# Altium project RFSOC_SAWG.PrjPCB (part 7 of 10)

## Sheet ADC_Input_CH.SchDoc: RFSOC_SAWG
size 420 x 297 mm; CheckedBy: -; Author: G.Kasprowicz; CompanyName: WUT ISE; DrawnBy: G.Kasprowicz; Organization: WUT ISE; Address1: PW ISE; Address2: Nowowiejska 15/19 00-665 Warsaw; Address3: gkasprow@gmail.com; DocumentNumber: 2; Revision: 1; SheetNumber: 2; SheetTotal: 20; ModifiedBy: -; CheckedDate: -; Title2: ADC Input; DivGrp: WUT ISE; Designer: G.Kasprowicz; ModifiedDate: -; ProjectName: Sensor Box
Used 8 times, as channels U_ADC_Input_CH0, U_ADC_Input_CH1, U_ADC_Input_CH2, U_ADC_Input_CH3, U_ADC_Input_CH4, U_ADC_Input_CH5, U_ADC_Input_CH6, U_ADC_Input_CH7. Parts and nets are listed once, with the designators drawn on the sheet.
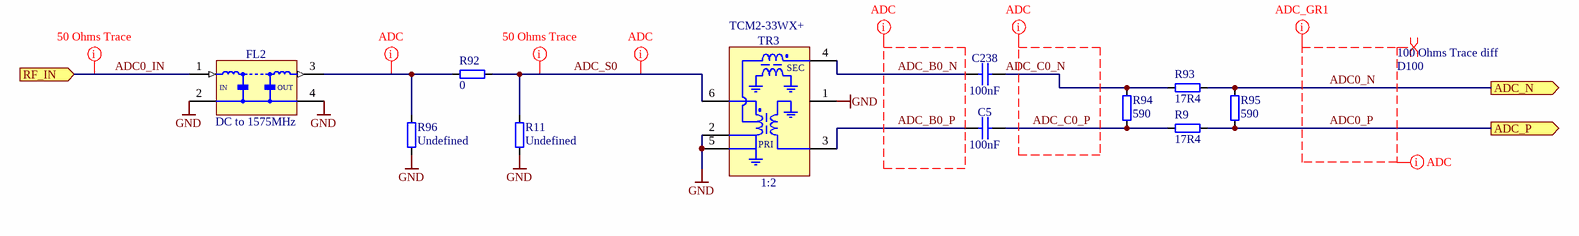
[diagram p13: ADC_Input_CH.SchDoc]

### Parts
C5  100nF  [CAPC0603X33N]
C238  100nF  [CAPC0603X33N]
FL2  DC to 1575MHz  [FIL_MINI-CIRCUITS_FV1206]
R9  17R4  [RESC1005X40N]
R11  Undefined  [RESC1005X40N]
R92  0  [RESC1005X40N]
R93  17R4  [RESC1005X40N]
R94  590  [RESC1005X40N]
R95  590  [RESC1005X40N]
R96  Undefined  [RESC1005X40N]
TR3  1:2  Manufacturer Part Number: TCM2-33WX+  [XFMR_MINI-CIRCUITS_DB1627]

### Ports
ADC_N (out), ADC_P (out), RF_IN (in)

### Nets
GND: FL2.2(GND) FL2.4(GND) R11.2 R96.2 TR3.1(NC) TR3.2(P) TR3.5(GND)
ADC0_IN: FL2.1(RFIN) ; port RF_IN
ADC0_N: R93.2 R95.1 ; port ADC_N
ADC0_P: R9.2 R95.2 ; port ADC_P
ADC_B0_N: C238.1 TR3.4(SD)
ADC_B0_P: C5.1 TR3.3(S)
ADC_C0_N: C238.2 R93.1 R94.1
ADC_C0_P: C5.2 R9.1 R94.2
ADC_S0: R11.1 R92.2 TR3.6(P1)
NetFL2_3: FL2.3(RFOUT) R92.1 R96.1

### Channels
U_ADC_Input_CH0: designators end in A; ports ADC_N=ADC0_N ADC_P=ADC0_P RF_IN=ADC0_IN
U_ADC_Input_CH1: designators end in B; ports ADC_N=ADC0_N ADC_P=ADC0_P RF_IN=ADC0_IN
U_ADC_Input_CH2: designators end in C; ports ADC_N=ADC0_N ADC_P=ADC0_P RF_IN=ADC0_IN
U_ADC_Input_CH3: designators end in D; ports ADC_N=ADC0_N ADC_P=ADC0_P RF_IN=ADC0_IN
U_ADC_Input_CH4: designators end in E; ports ADC_N=ADC0_N ADC_P=ADC0_P RF_IN=ADC0_IN
U_ADC_Input_CH5: designators end in F; ports ADC_N=ADC0_N ADC_P=ADC0_P RF_IN=ADC0_IN
U_ADC_Input_CH6: designators end in G; ports ADC_N=ADC0_N ADC_P=ADC0_P RF_IN=ADC0_IN
U_ADC_Input_CH7: designators end in H; ports ADC_N=ADC0_N ADC_P=ADC0_P RF_IN=ADC0_IN

### Layout directives
differential pair; differential pair class 100 Ohms Trace diff; net class D100: ADC0_N, ADC0_P
net class ADC_GR1: ADC0_N, ADC0_P
net class 50 Ohms Trace: ADC0_IN, ADC_S0_U_ADC_Input_CH0
net class ADC: ADC0_N, ADC0_P, ADC_B0_N, ADC_B0_P, ADC_C0_P, ADC_S0_U_ADC_Input_CH0, NetFL2A_3

### Notes on the sheet
- Project/Equipment
- Document
- Designer
- Drawn by
- Check.by
- Copyright WUT ISE 2020.
  This documentation describes Open Hardware and is licensed under the CERN OHL v.1.2. You may redistribute and modify this documentation under the terms of the CERN OHL v.1.2. (http://ohwr.org/CERNOHL). This documentation is distributed WITHOUT ANY EXPRESS OR IMPLIED WARRANTY, INCLUDING OF MERCHANTABILITY, SATISFACTORY QUALITY AND FITNESS FOR A PARTICULAR PURPOSE. Please see the CERN OHL v.1.2 for applicable conditions.
- Contact
- File
- Last Mod.
- Print Date
- Sheet
- Size
- A3
- of
- Rev
- (in symbol FIL_MINI-CIRCUITS_LFCN-1575+) IN; OUT
- (in symbol XFMR_MINI-CIRCUITS_TCM2-33WX+) SEC; PRI

### Library data of the parts
C5 C238 = CC0201_100NF_6.3V_10%_X5R: Non-polarised capacitor; Part Description: SMD Multilayer Chip Ceramic Capacitor; Manufacturer: GENERIC; Manufacturer1 Part Number: 02016D104KAT2A; Voltage: 6.3V; TC: X5R; Tolerance: ±10%; Part Number: CC0201_100NF_6.3V_10%_X5R; Component Kind: Standard; Component Type: Standard; Pin Count: 2; Value: 100nF; Status: Not Recommended; Manufacturer Part Number: CC0201_100NF_6.3V_10%_X5R; Case: 0201; Mounted: Yes; Socket: No; SMD: Yes; Sense: No; Manufacturer1 Example: AVX; Manufacturer1 ComponentHeight: 0.33mm; HelpURL: \\cern.ch\dfs\Applications\Altium\Datasheets\CC0201_X5R_AVX.pdf; Author: CERN DEM JLC; CreateDate: 03.12.2007; LatestRevisionDate: 03.12.2007
FL2 = FIL_MINI-CIRCUITS_LFCN-1575+: 50 Ohm Low Pass Filter; Part Number: FIL_MINI-CIRCUITS_LFCN-1575+; Component Kind: Standard; Component Type: Standard; Pin Count: 4; Value: DC to 1575MHz; Part Description: 50 Ohm Low Pass Filter; Manufacturer: MINI-CIRCUITS; Manufacturer Part Number: LFCN-1575+; Mounted: Yes; Socket: No; SMD: Yes; Sense: No; ComponentHeight: 0.94mm; HelpURL: \\cern.ch\dfs\Applications\Altium\Datasheets\FIL_MINI-CIRCUITS_LFCN-1575+.pdf; Author: CERN DEM JLC; CreateDate: 21.04.2014; LatestRevisionDate: 21.04.2015
R9 R93 = R0402_17R4_1%_0.1W_100PPM: Resistor - 1%; Part Description: General Purpose Thick Film Chip Resistor; Manufacturer: GENERIC; Manufacturer1 Part Number: ERJ2RKF17R4X; Voltage: 50V; Power: 0.1W; TC: ±100ppm/°C; PressFit: No; Case: 0402; Value: 17R4; Tolerance: ±1%; Part Number: R0402_17R4_1%_0.1W_100PPM; Component Kind: Standard; Component Type: Standard; Pin Count: 2; Status: Not Recommended; Manufacturer Part Number: R0402_17R4_1%_0.1W_100PPM; Mounted: Yes; Sense: No; Socket: No; SMD: Yes; Manufacturer1 Example: PANASONIC; Manufacturer1 ComponentHeight: 0.4mm; HelpURL: \\cern.ch\dfs\Applications\Altium\Datasheets\R0402_PANASONIC_ERJ2RK.pdf; Author: CERN DEM BC; CreateDate: 19.04.2021; LatestRevisionDate: 19.04.2021
R11 R96 = R0402_NO-VALUE: Resistor; Part Description: Reserved Footprint For a 0402 (1005) Chip Resistor; PressFit: No; Mounted: No; Case: 0402; Value: Undefined; Part Number: R0402_NO-VALUE; Component Kind: Standard; Component Type: Standard; Pin Count: 2; Status: None; Manufacturer: Undefined; Manufacturer Part Number: R0402_NO-VALUE; Sense: No; Socket: No; SMD: Yes; Manufacturer1 Example: Undefined; Manufacturer1 Part Number: Undefined; Manufacturer1 ComponentHeight: Undefined; HelpURL: Undefined; Author: CERN DEM JLC; CreateDate: 03.12.2007; LatestRevisionDate: 13.03.2008
R92 = R0402_0R_JUMPER: Resistor; Part Description: 1A (0.05R Max DC Resistance) Zero Ohm Jumper; Manufacturer: GENERIC; Manufacturer1 Part Number: 232270591001L; PressFit: No; Case: 0402; Value: 0; Part Number: R0402_0R_JUMPER; Component Kind: Standard; Component Type: Standard; Pin Count: 2; Status: Not Recommended; Manufacturer Part Number: R0402_0R_JUMPER; Mounted: Yes; Sense: No; Socket: No; SMD: Yes; Manufacturer1 Example: YAGEO PHYCOMP; Manufacturer1 ComponentHeight: 0.4mm; HelpURL: \\cern.ch\dfs\Applications\Altium\Datasheets\R0402_Phycomp_RC0402.pdf; Author: CERN DEM JLC; CreateDate: 03.12.2007; LatestRevisionDate: 17.10.2012
R94 R95 = R0402_590R_1%_0.1W_100PPM: Resistor - 1%; Part Description: General Purpose Thick Film Chip Resistor; Manufacturer: GENERIC; Manufacturer1 Part Number: ERJ2RKF5900X; Voltage: 50V; Power: 0.1W; TC: ±100ppm/°C; PressFit: No; Case: 0402; Value: 590; Tolerance: ±1%; Part Number: R0402_590R_1%_0.1W_100PPM; Component Kind: Standard; Component Type: Standard; Pin Count: 2; Status: Not Recommended; Manufacturer Part Number: R0402_590R_1%_0.1W_100PPM; Mounted: Yes; Sense: No; Socket: No; SMD: Yes; Manufacturer1 Example: PANASONIC; Manufacturer1 ComponentHeight: 0.4mm; HelpURL: \\cern.ch\dfs\Applications\Altium\Datasheets\R0402_PANASONIC_ERJ2RK.pdf; Author: CERN DEM BC; CreateDate: 19.04.2021; LatestRevisionDate: 19.04.2021
TR3 = XFMR_MINI-CIRCUITS_TCM2-33WX+: 50 OHMS 10 to 3000 MHz RF Transformer; Power: 0.4W; Part Number: XFMR_MINI-CIRCUITS_TCM2-33WX+; Component Kind: Standard; Component Type: Standard; Pin Count: 6; Value: 1:2; Status: None; Part Description: 50 Ohms 10 to 3000MHz RF Transformer; Manufacturer: MINI-CIRCUITS; Mounted: Yes; Socket: No; Sense: No; SMD: Yes; ComponentHeight: 4.06mm; HelpURL: \\cern.ch\dfs\Applications\Altium\Datasheets\XFMR_MINI-CIRCUITS_TCM2-33WX+.pdf; Author: CERN DEM MR; CreateDate: 01.12.2016; LatestRevisionDate: 01.12.2016

## Sheet AWG_SFPs.SchDoc: SFP
size 420 x 297 mm; EDA_Number: ARTIQ; Projet: ARTIQ/SINARA; CheckedBy: G.Kasprowicz; Author: F.Switakowski; CompanyName: WUT ISE; DrawnBy: F.Switakowski; Organization: WUT ISE; Address1: PW ISE; Address2: Nowowiejska 15/19 00-665 Warsaw; Address3: gkasprow@gmail.com; DocumentNumber: 8; Revision: 1; SheetNumber: 8; SheetTotal: 20; ModifiedBy: -; CheckedDate: -; Title2: cages; DivGrp: WUT ISE; Designer: G.Kasprowicz; ModifiedDate: -; ProjectName: Sensor Box
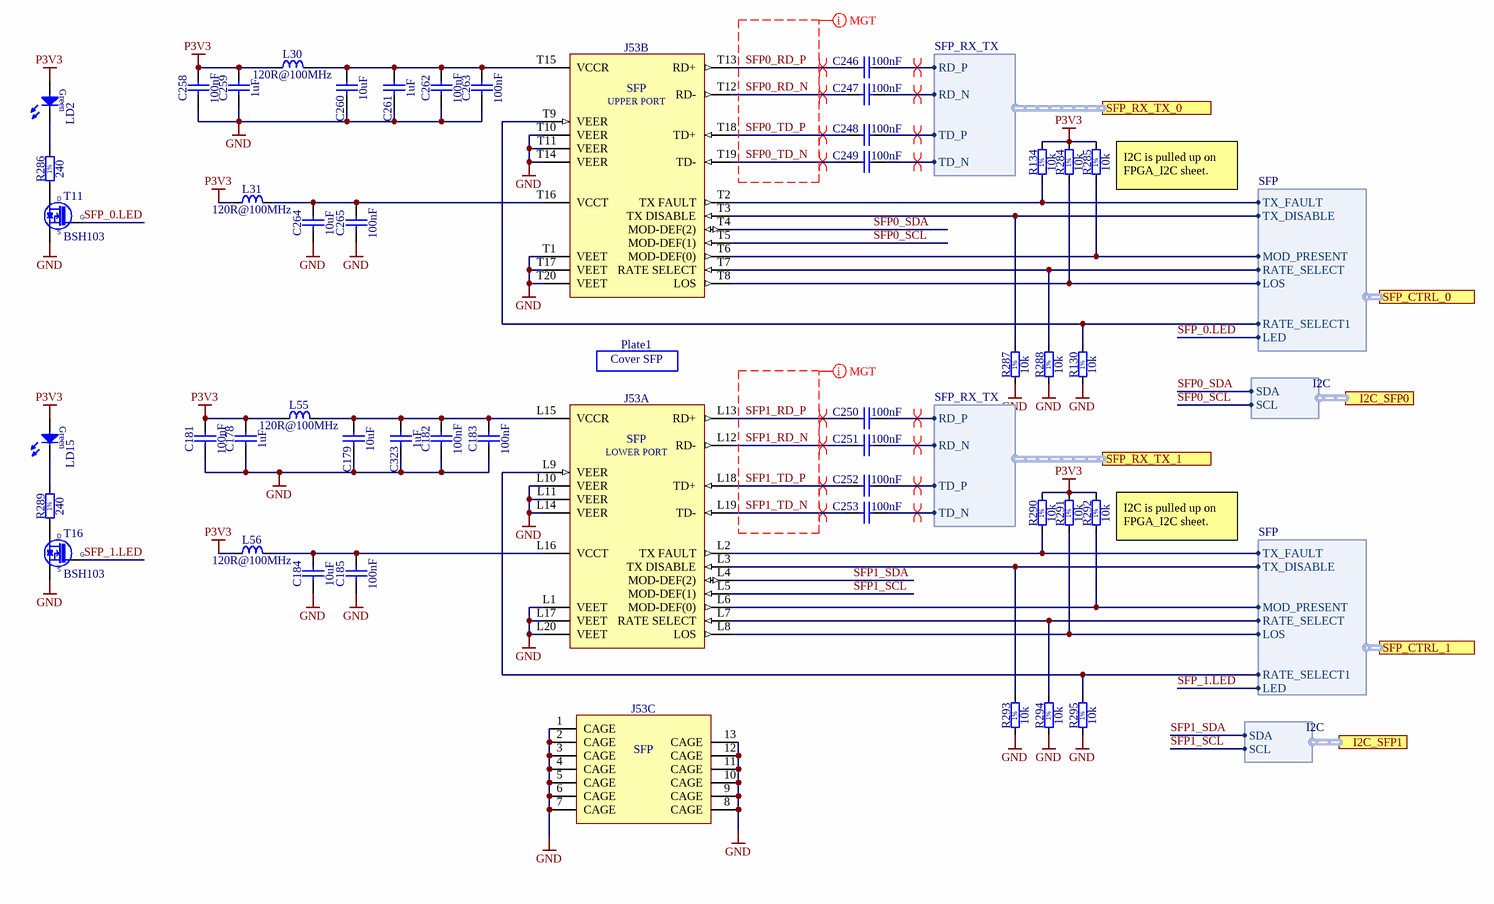
[diagram p14: AWG_SFPs.SchDoc]

### Parts
C178  1uF  [CAPC1005X55N]
C179  10uF  [CAPC2012X95N]
C181  100nF  [CAPC1005X55N]
C182  100nF  [CAPC1005X55N]
C183  100nF  [CAPC1005X55N]
C184  10uF  [CAPC2012X95N]
C185  100nF  [CAPC1005X55N]
C246  100nF  [CAPC0603X33N]
C247  100nF  [CAPC0603X33N]
C248  100nF  [CAPC0603X33N]
C249  100nF  [CAPC0603X33N]
C250  100nF  [CAPC0603X33N]
C251  100nF  [CAPC0603X33N]
C252  100nF  [CAPC0603X33N]
C253  100nF  [CAPC0603X33N]
C258  100nF  [CAPC1005X55N]
C259  1uF  [CAPC1005X55N]
C260  10uF  [CAPC2012X95N]
C261  1uF  [CAPC1005X55N]
C262  100nF  [CAPC1005X55N]
C263  100nF  [CAPC1005X55N]
C264  10uF  [CAPC2012X95N]
C265  100nF  [CAPC1005X55N]
C323  1uF  [CAPC1005X55N]
J53  SFP  [MOLEX_75640-5001]  (parts A,B,C of 3)
L30  120R@100MHz  [INDC1608X65N]
L31  120R@100MHz  [INDC1608X65N]
L55  120R@100MHz  [INDC1608X65N]
L56  120R@100MHz  [INDC1608X65N]
LD2  Green  [LED_AVAGO_HSME-C120]  (value not drawn)
LD15  Green  [LED_AVAGO_HSME-C120]  (value not drawn)
Plate1  Cover SFP  [AMPHENOL_U77A11108000P]
R130  10k  [RESC1005X40N]
R134  10k  [RESC1005X40N]
R284  10k  [RESC1005X40N]
R285  10k  [RESC1005X40N]
R286  240  [RESC1005X40N]
R287  10k  [RESC1005X40N]
R288  10k  [RESC1005X40N]
R289  240  [RESC1005X40N]
R290  10k  [RESC1005X40N]
R291  10k  [RESC1005X40N]
R292  10k  [RESC1005X40N]
R293  10k  [RESC1005X40N]
R294  10k  [RESC1005X40N]
R295  10k  [RESC1005X40N]
T11  BSH103  [SOT95P230X110-3N]
T16  BSH103  [SOT95P230X110-3N]

### Ports
I2C_SFP0 (harness I2C), I2C_SFP1 (harness I2C), SFP_CTRL_0 (harness SFP), SFP_CTRL_1 (harness SFP), SFP_RX_TX_0 (harness SFP_RX_TX), SFP_RX_TX_1 (harness SFP_RX_TX)

### Harnesses
SFP_RX_TX: RD_P, RD_N, TD_P, TD_N
SFP: TX_FAULT, LOS, MOD_PRESENT, TX_DISABLE, RATE_SELECT, LED, RATE_SELECT1
I2C: SDA, SCL

### Nets
GND: C178.1 C179.1 C181.1 C182.1 C183.1 C184.1 C185.1 C258.1 C259.1 C260.1 C261.1 C262.1 C263.1 C264.1 C265.1 C323.1 J53.1(CAGE) J53.2(CAGE) J53.3(CAGE) J53.4(CAGE) J53.5(CAGE) J53.6(CAGE) J53.7(CAGE) J53.8(CAGE) J53.9(CAGE) J53.10(CAGE) J53.11(CAGE) J53.12(CAGE) J53.13(CAGE) J53.L1(VEET) J53.L10(VEER) J53.L11(VEER) J53.L14(VEER) J53.L17(VEET) J53.L20(VEET) J53.T1(VEET) J53.T10(VEER) J53.T11(VEER) J53.T14(VEER) J53.T17(VEET) J53.T20(VEET) R130.1 R287.1 R288.1 R293.1 R294.1 R295.1 T11.2(S) T16.2(S)
P3V3: C178.2 C181.2 C258.2 C259.2 L30.1 L31.1 L55.1 L56.1 LD2.2(A) LD15.2(A) R134.2 R284.2 R285.2 R290.2 R291.2 R292.2
B129_RX0_N: C247.2 ; port SFP_RX_TX_0.RD_N
B129_RX0_P: C246.2 ; port SFP_RX_TX_0.RD_P
B129_RX1_N: C251.2 ; port SFP_RX_TX_1.RD_N
B129_RX1_P: C250.2 ; port SFP_RX_TX_1.RD_P
B129_TX0_N: C249.2 ; port SFP_RX_TX_0.TD_N
B129_TX0_P: C248.2 ; port SFP_RX_TX_0.TD_P
B129_TX1_N: C253.2 ; port SFP_RX_TX_1.TD_N
B129_TX1_P: C252.2 ; port SFP_RX_TX_1.TD_P
SFP0_LOS: J53.T8(LOS) R284.1 ; port SFP_CTRL_0.LOS
SFP0_MOD_PRESENT: J53.T6(MOD-DEF(0)) R285.1 ; port SFP_CTRL_0.MOD_PRESENT
SFP0_RATE_SELECT: J53.T7(RATE_SELECT) R288.2 ; port SFP_CTRL_0.RATE_SELECT
SFP0_RATE_SELECT1: J53.T9(VEER) R130.2 ; port SFP_CTRL_0.RATE_SELECT1
SFP0_RD_N: C247.1 J53.T12(RD-)
SFP0_RD_P: C246.1 J53.T13(RD+)
SFP0_SCL: J53.T5(MOD-DEF(1)) ; port I2C_SFP0.SCL
SFP0_SDA: J53.T4(MOD-DEF(2)) ; port I2C_SFP0.SDA
SFP0_TD_N: C249.1 J53.T19(TD-)
SFP0_TD_P: C248.1 J53.T18(TD+)
SFP0_TX_DISABLE: J53.T3(TX_DISABLE) R287.2 ; port SFP_CTRL_0.TX_DISABLE
SFP0_TX_FAULT: J53.T2(TX_FAULT) R134.1 ; port SFP_CTRL_0.TX_FAULT
SFP1_LOS: J53.L8(LOS) R291.1 ; port SFP_CTRL_1.LOS
SFP1_MOD_PRESENT: J53.L6(MOD-DEF(0)) R292.1 ; port SFP_CTRL_1.MOD_PRESENT
SFP1_RATE_SELECT: J53.L7(RATE_SELECT) R294.2 ; port SFP_CTRL_1.RATE_SELECT
SFP1_RATE_SELECT1: J53.L9(VEER) R295.2 ; port SFP_CTRL_1.RATE_SELECT1
SFP1_RD_N: C251.1 J53.L12(RD-)
SFP1_RD_P: C250.1 J53.L13(RD+)
SFP1_SCL: J53.L5(MOD-DEF(1)) ; port I2C_SFP1.SCL
SFP1_SDA: J53.L4(MOD-DEF(2)) ; port I2C_SFP1.SDA
SFP1_TD_N: C253.1 J53.L19(TD-)
SFP1_TD_P: C252.1 J53.L18(TD+)
SFP1_TX_DISABLE: J53.L3(TX_DISABLE) R293.2 ; port SFP_CTRL_1.TX_DISABLE
SFP1_TX_FAULT: J53.L2(TX_FAULT) R290.1 ; port SFP_CTRL_1.TX_FAULT
SFP_0.LED: T11.1(G) ; port SFP_CTRL_0.LED  [project net SFP0_LED]
SFP_1.LED: T16.1(G) ; port SFP_CTRL_1.LED  [project net SFP1_LED]
NetC179_2: C179.2 C182.2 C183.2 C323.2 J53.L15(VCCR) L55.2
NetC184_2: C184.2 C185.2 J53.L16(VCCT) L56.2
NetC260_2: C260.2 C261.2 C262.2 C263.2 J53.T15(VCCR) L30.2
NetC264_2: C264.2 C265.2 J53.T16(VCCT) L31.2
NetLD2_1: LD2.1(C) R286.2
NetLD15_1: LD15.1(C) R289.2
NetR286_1: R286.1 T11.3(D)
NetR289_1: R289.1 T16.3(D)

### Layout directives
differential pair; differential pair class Diff_100Ohm: B129_RX0_N, B129_RX0_P, B129_RX1_N, B129_RX1_P, B129_TX0_N, B129_TX0_P, B129_TX1_N, B129_TX1_P, SFP0_RD_N, SFP0_RD_P, SFP0_TD_N, SFP0_TD_P, SFP1_RD_N, SFP1_RD_P, SFP1_TD_N, SFP1_TD_P
net class MGT: SFP0_RD_N, SFP0_RD_P, SFP0_TD_N, SFP0_TD_P, SFP1_RD_N, SFP1_RD_P, SFP1_TD_N, SFP1_TD_P

### Notes on the sheet
- (near R285) I2C is pulled up on FPGA_I2C sheet.
- (near R292) I2C is pulled up on FPGA_I2C sheet.
- Project/Equipment
- Document
- Designer
- Drawn by
- Check.by
- Copyright WUT ISE 2020.
  This documentation describes Open Hardware and is licensed under the CERN OHL v.1.2. You may redistribute and modify this documentation under the terms of the CERN OHL v.1.2. (http://ohwr.org/CERNOHL). This documentation is distributed WITHOUT ANY EXPRESS OR IMPLIED WARRANTY, INCLUDING OF MERCHANTABILITY, SATISFACTORY QUALITY AND FITNESS FOR A PARTICULAR PURPOSE. Please see the CERN OHL v.1.2 for applicable conditions.
- Contact
- File
- Last Mod.
- Print Date
- Sheet
- Size
- A3
- of
- Rev
- (in symbol MOLEX_75640-5001, part A) LOWER PORT
- (in symbol MOLEX_75640-5001, part B) UPPER PORT
- (in symbol R0402_10K_1%_0.0625W_100PPM) 1%
- (in symbol R0402_240R_1%_0.0625W_100PPM) 1%

### Library data of the parts
C178 C259 C261 C323 = CC0402_1UF_16V_10%_X5R: Non-polarised capacitor; Part Description: SMD Multilayer Chip Ceramic Capacitor; Manufacturer: GENERIC; Manufacturer1 Part Number: C1005X5R1C105KT; Voltage: 16V; TC: X5R; Tolerance: ±10%; Part Number: CC0402_1UF_16V_10%_X5R; Component Kind: Standard; Component Type: Standard; Pin Count: 2; Value: 1uF; Status: Preferred; Manufacturer Part Number: CC0402_1UF_16V_10%_X5R; Case: 0402; Mounted: Yes; Socket: No; SMD: Yes; Sense: No; Manufacturer1 Example: TDK; Manufacturer1 ComponentHeight: 0.55mm; HelpURL: \\cern.ch\dfs\Applications\Altium\Datasheets\CC0402_X5R_TDK_C.pdf; Author: CERN DEM JLC; CreateDate: 2012-10-25; LatestRevisionDate: 2012-10-25
C179 C184 C260 C264 = CC0805_10UF_25V_10%_X5R: Non-polarised capacitor; Part Description: SMD Multilayer Chip Ceramic Capacitor; Manufacturer: GENERIC; Manufacturer1 Part Number: GRM219R61E106KA12D; Voltage: 25V; TC: X5R; Tolerance: ±10%; Part Number: CC0805_10UF_25V_10%_X5R; Component Kind: Standard; Component Type: Standard; Pin Count: 2; Value: 10uF; Status: Preferred; Manufacturer Part Number: CC0805_10UF_25V_10%_X5R; Case: 0805; Mounted: Yes; Socket: No; SMD: Yes; Sense: No; Manufacturer1 Example: MURATA; Manufacturer1 ComponentHeight: 0.95mm; HelpURL: \\cern.ch\dfs\Applications\Altium\Datasheets\CC0805_X5R_MURATA_GRM.pdf; Author: CERN DEM JLC; CreateDate: 25.10.2012; LatestRevisionDate: 06.09.2016
C181-C183 C185 C258 C262 C263 C265 = CC0402_100NF_16V_10%_X7R: Non-polarised capacitor; Part Description: SMD Multilayer Chip Ceramic Capacitor; Manufacturer: GENERIC; Manufacturer1 Part Number: GRM155R71C104KA88D; Voltage: 16V; TC: X7R; Tolerance: ±10%; Part Number: CC0402_100NF_16V_10%_X7R; Component Kind: Standard; Component Type: Standard; Pin Count: 2; Value: 100nF; Status: Not Recommended; Manufacturer Part Number: CC0402_100NF_16V_10%_X7R; Case: 0402; Mounted: Yes; Socket: No; SMD: Yes; Sense: No; Manufacturer1 Example: MURATA; Manufacturer1 ComponentHeight: 0.55mm; HelpURL: \\cern.ch\dfs\Applications\Altium\Datasheets\CC0402_X7R_MURATA_GRM.pdf; Author: CERN DEM JLC; CreateDate: 05/12/2013; LatestRevisionDate: 03/12/2007
C246-C253 = CC0201_100NF_6.3V_10%_X5R: as C5 on sheet ADC_Input_CH; Part Number: CC0201_100NF_6.3V_10%_X5R; Component Kind: Standard; Component Type: Standard; Pin Count: 2; Value: 100nF; Status: Not Recommended; Manufacturer Part Number: CC0201_100NF_6.3V_10%_X5R; Case: 0201; Mounted: Yes; Socket: No; SMD: Yes; Sense: No; Manufacturer1 Example: AVX; Manufacturer1 ComponentHeight: 0.33mm; HelpURL: \\cern.ch\dfs\Applications\Altium\Datasheets\CC0201_X5R_AVX.pdf; Author: CERN DEM JLC; CreateDate: 2007-12-03; LatestRevisionDate: 2007-12-03; ClassName: SATA
J53 = MOLEX_75640-5001: Dual 20 Positions Stacked SFP (Small Form-factor Pluggable) Receptacles with 4 Light Pipes, Medium Height Assembly, Press Fit Tails; Part Description: Dual Stacked SFP Cage (Small Form-factor Pluggable) with 2x20 Positions Integrated Receptacles and 4 Light Pipes (Press Fit Tails); Manufacturer: MOLEX; Part Number: MOLEX_75640-5001; Component Kind: Standard; Component Type: Standard; Pin Count: 53; Family: SFP; Mounted: Yes; Socket: No; SMD: Yes; PressFit: Yes; Sense: No; Status: None; Manufacturer Part Number: 75640-5001; ComponentHeight: 25.8mm; HelpURL: \\cern.ch\dfs\Applications\Altium\Datasheets\MOLEX_75640-5001.pdf; Author: CERN DEM JLC; CreateDate: 15.10.2013; LatestRevisionDate: 15.10.2013
L30 L31 L55 L56 = IND0603_MURATA_BLM18SG121TN1D: Inductor; Part Description: SMD EMIFIL Suppression Chip Ferrite Bead; Manufacturer: MURATA; Power: 3A; Resistance: 0.025R; Tolerance: ±25%; Part Number: IND0603_MURATA_BLM18SG121TN1D; Component Kind: Standard; Component Type: Standard; Pin Count: 2; Value: 120R@100MHz; Status: None; Manufacturer Part Number: BLM18SG121TN1D; Case: 0603; Mounted: Yes; Socket: No; SMD: Yes; Sense: No; ComponentHeight: 0.65mm; HelpURL: \\cern.ch\dfs\Applications\Altium\Datasheets\IND0603_MURATA_BLM18S.pdf; Author: CERN DEM JLC; CreateDate: 23.07.2014; LatestRevisionDate: 23.07.2014
LD2 LD15 = LED_AVAGO_HSME-C120: LED Green 1C 2A; Part Description: High Performance Right Angle Chip Green LED; Manufacturer: AVAGO TECHNOLOGIES; PressFit: No; Bonding: No; Part Number: LED_AVAGO_HSME-C120; Component Kind: Standard; Component Type: Standard; Color: Green; PackageDescription: Green Chip LED, 2-Leads, Body 1.7x1.1mm, Side Emitting Package; Manufacturer Part Number: HSME-C120; Pin Count: 2; Mounted: Yes; Socket: No; SMD: Yes; Sense: No; ComponentHeight: 0.7mm; HelpURL: \\cern.ch\dfs\Applications\Altium\Datasheets\LED_AVAGO_HSME-C120.pdf; ComponentLink1URL: \\cern.ch\dfs\Applications\Altium\Datasheets\LED_AVAGO_HSME-C110_DESIGN-GUIDE.pdf; ComponentLink1Description: Design Guide; Author: CERN DEM JMW; CreateDate: 22.07.2009; LatestRevisionDate: 20.06.2012
Plate1 = AMPHENOL_U77A11108000P: Plastic Dust Cover SFP Cage; PressFit: No; Part Number: AMPHENOL_U77A11108000P; Component Kind: Accessories; Component Type: Standard; Pin Count: 0; PackageDescription: Plastic Dust Cover SFP Cage; Mounted: Yes; Socket: No; SMD: No; Sense: No; Status: None; Value: Cover SFP; Part Description: Plastic Dust Cover SFP Cage; Manufacturer: AMPHENOL; Manufacturer Part Number: U77A11108000P; ComponentHeight: 10.2mm; HelpURL: \\cern.ch\dfs\Applications\Altium\Datasheets\AMPHENOL_U77A11108000P.pdf; Author: CERN DEM BC; CreateDate: 28.10.2019; LatestRevisionDate: 28.10.2019
R130 R134 R284 R285 R287 R288 R290-R295 = R0402_10K_1%_0.0625W_100PPM: Resistor - 1%; Part Description: General Purpose Thick Film Chip Resistor; Manufacturer: GENERIC; Manufacturer1 Part Number: 232270671003L; TC: ±100ppm/°C; PressFit: No; Part Number: R0402_10K_1%_0.0625W_100PPM; Component Kind: Standard; Component Type: Standard; Pin Count: 2; Value: 10k; Status: Not Recommended; Power: 0.0625W; Tolerance: ±1%; Manufacturer Part Number: R0402_10K_1%_0.0625W_100PPM; Case: 0402; Mounted: Yes; Sense: No; Socket: No; SMD: Yes; Manufacturer1 Example: YAGEO PHYCOMP; Manufacturer1 ComponentHeight: 0.4mm; HelpURL: \\cern.ch\dfs\Applications\Altium\Datasheets\R0402_Phycomp_RC0402.pdf; Author: CERN DEM JLC; CreateDate: 03.12.2007; LatestRevisionDate: 17.10.2012
R286 R289 = R0402_240R_1%_0.0625W_100PPM: Resistor - 1%; Part Description: General Purpose Thick Film Chip Resistor; Manufacturer: GENERIC; Manufacturer1 Part Number: 232270672401L; TC: ±100ppm/°C; PressFit: No; Part Number: R0402_240R_1%_0.0625W_100PPM; Component Kind: Standard; Component Type: Standard; Pin Count: 2; Value: 240; Status: Not Recommended; Power: 0.0625W; Tolerance: ±1%; Manufacturer Part Number: R0402_240R_1%_0.0625W_100PPM; Case: 0402; Mounted: Yes; Sense: No; Socket: No; SMD: Yes; Manufacturer1 Example: YAGEO PHYCOMP; Manufacturer1 ComponentHeight: 0.4mm; HelpURL: \\cern.ch\dfs\Applications\Altium\Datasheets\R0402_Phycomp_RC0402.pdf; Author: CERN DEM JLC; CreateDate: 03.12.2007; LatestRevisionDate: 17.10.2012
T11 T16 = BSH103: N-CHANNEL MOSFET WITH DIODE; Part Description: 30V 850mA N-Channel Enhancement Mode Field-Effect Transistor; Manufacturer: NEXPERIA; PressFit: No; Bonding: No; Part Number: BSH103; Component Kind: Standard; Component Type: Standard; Device: BSH103; PackageDescription: SOT23, 3 pin, Pitch 0.95mm - 1.3mm W X 2.9mm L X 1.1mm H, IPC Medium Density; Manufacturer Part Number: BSH103; Pin Count: 3; Case: SOT23-3; Mounted: Yes; Socket: No; SMD: Yes; Sense: No; ComponentHeight: 1.1mm; HelpURL: \\cern.ch\dfs\Applications\Altium\Datasheets\BSH103.pdf; Author: CERN DEM JLC; CreateDate: 16.03.2010; LatestRevisionDate: 20.06.2017